# Altium schematic sheet Analyzer_PowerSchematic.SchDoc
size A3; SheetNumber: 3; SheetTotal: 3
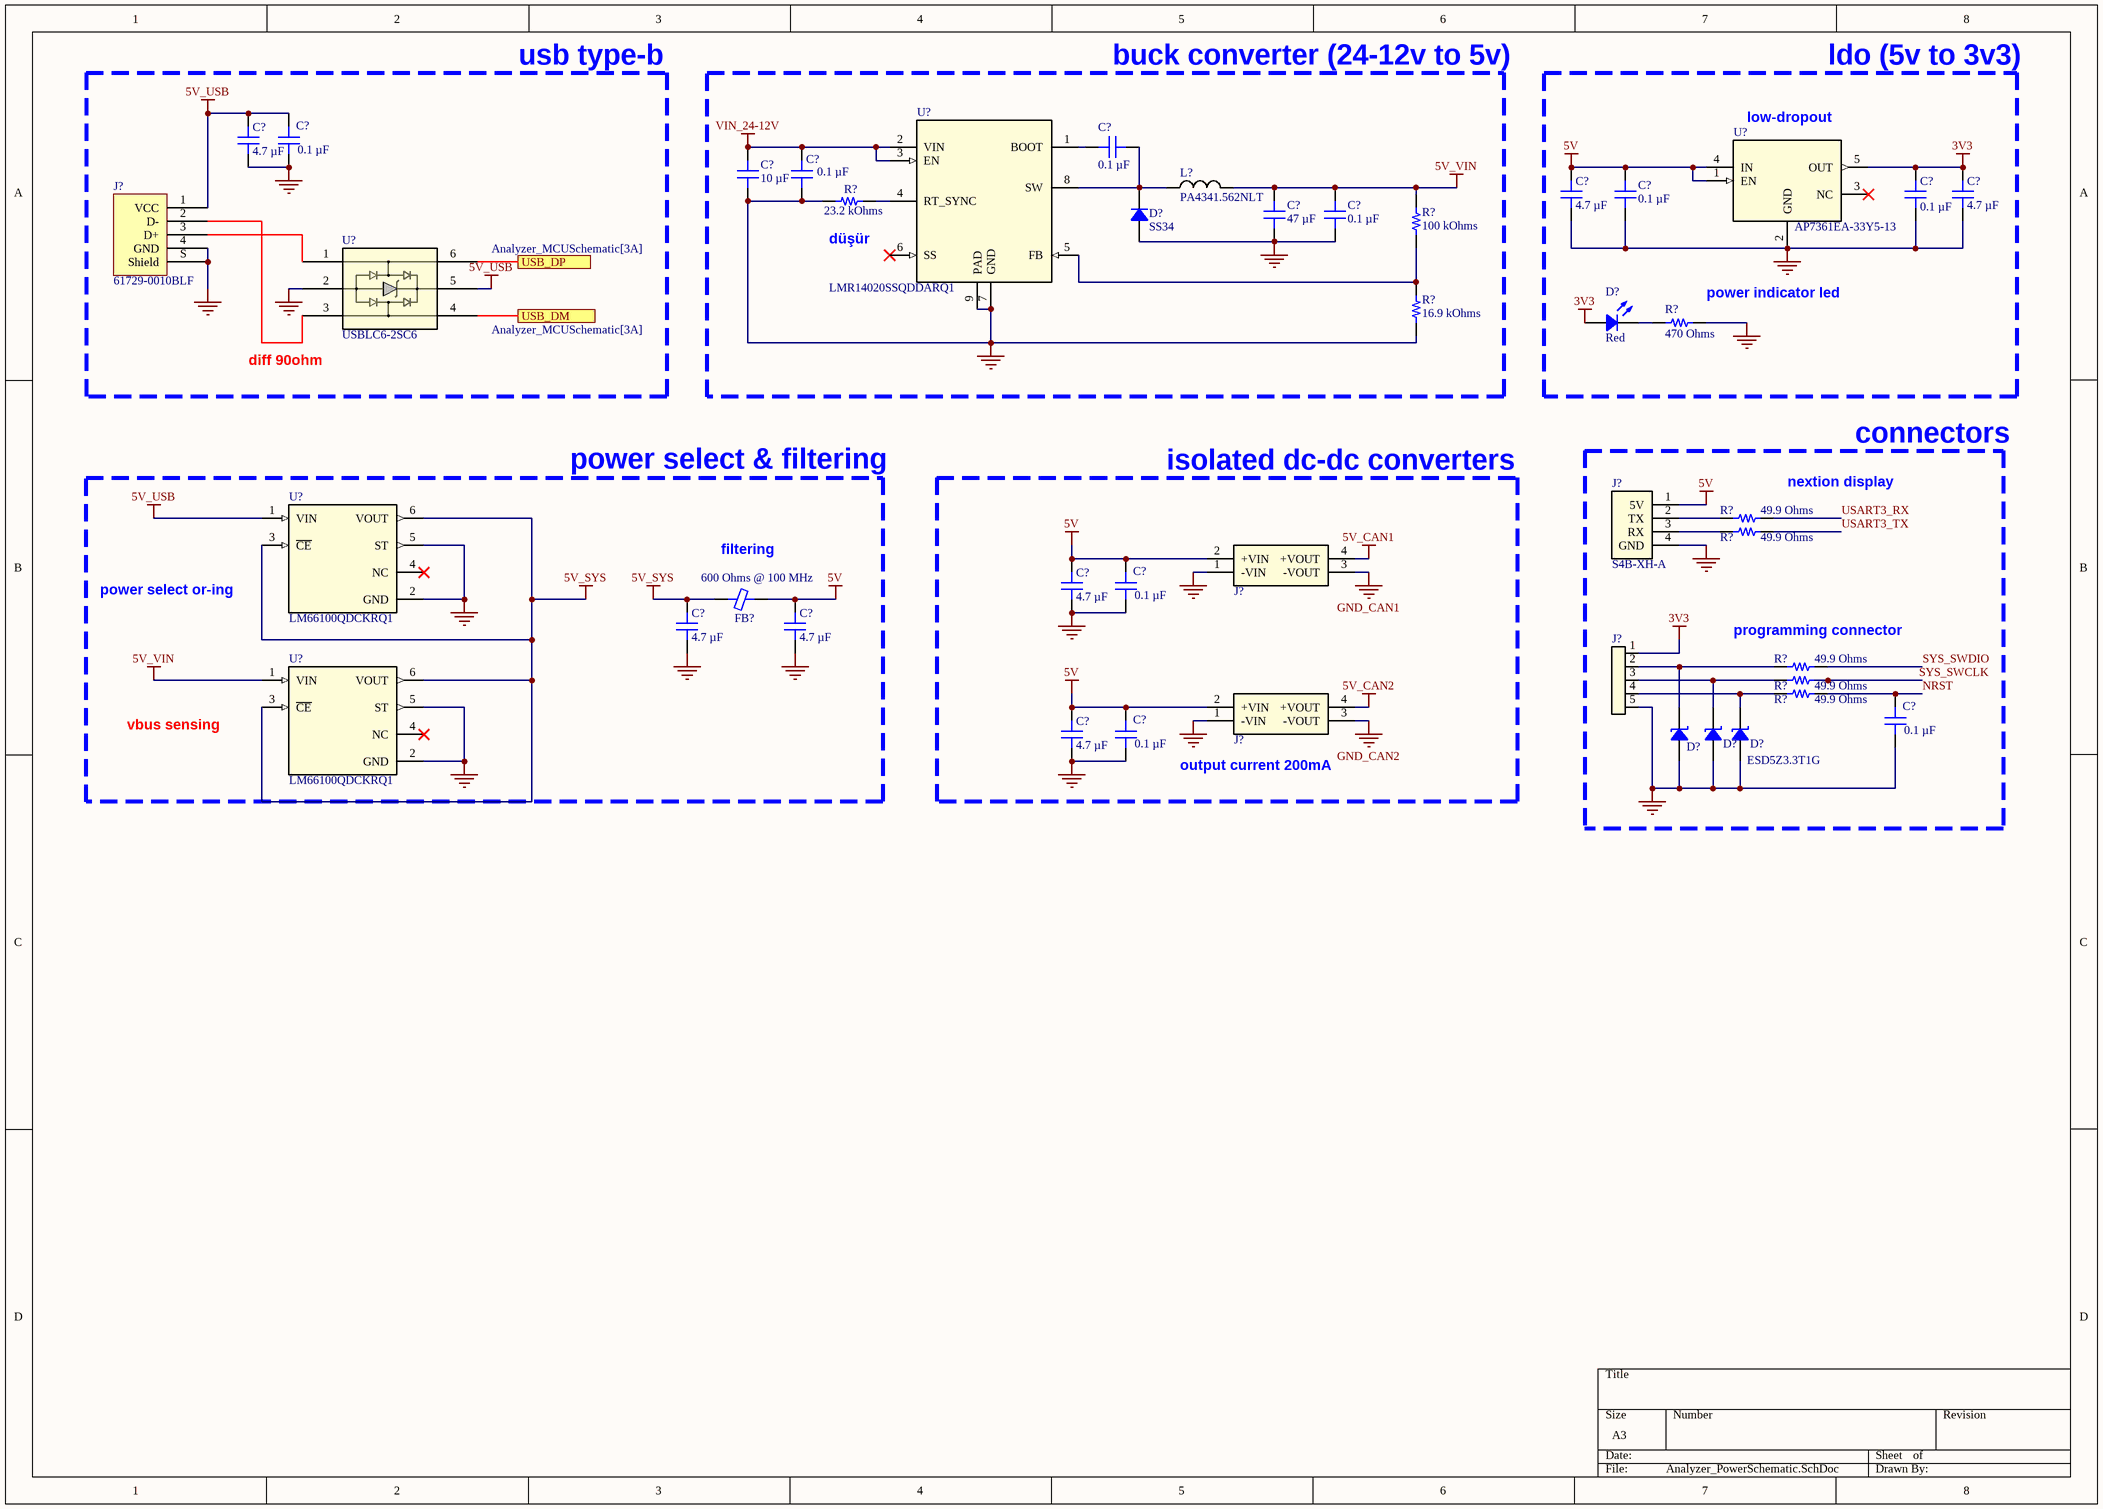
[diagram p0: Analyzer_PowerSchematic.SchDoc]

## Parts
(Parts that share a designator on the sheet are numbered #1, #2 ... from top to bottom, then left to right.)
C?#1  4.7 µF  [CAP 0603_1608]
C?#2  0.1 µF  [CAP 0603_1608]
C?#3  0.1 µF  [CAP 0603_1608]
C?#4  10 µF  [CAP 0805_2012]
C?#5  0.1 µF  [CAP 0603_1608]
C?#6  4.7 µF  [CAP 0603_1608]
C?#7  0.1 µF  [CAP 0603_1608]
C?#8  0.1 µF  [CAP 0603_1608]
C?#9  4.7 µF  [CAP 0603_1608]
C?#10  47 µF  [CAP 1206_3216 - 0.8MM]
C?#11  0.1 µF  [CAP 0603_1608]
C?#12  4.7 µF  [CAP 0603_1608]
C?#13  0.1 µF  [CAP 0603_1608]
C?#14  4.7 µF  [CAP 0603_1608]
C?#15  4.7 µF  [CAP 0603_1608]
C?#16  0.1 µF  [CAP 0603_1608]
C?#17  4.7 µF  [CAP 0603_1608]
C?#18  0.1 µF  [CAP 0603_1608]
D?#1  SS34  [DO214AB SMC]
D?#2  Red  [LED 0603_1608 RED]
D?#3  ESD5Z3.3T1G  [SOD523F]
D?#4  ESD5Z3.3T1G  [SOD523F]  (value not drawn)
D?#5  ESD5Z3.3T1G  [SOD523F]  (value not drawn)
FB?  600 Ohms @ 100 MHz  [FER 0603_1608]
J?#1  61729-0010BLF  [FCI USB 61729-0010BLF]
J?#2  S4B-XH-A  [JST_S4B-XH-A]
J?#3  CRE1S0505SC  [CRE1S0505SC]  (value not drawn)
J?#4  6130XX11121_61300511121  [61300511121]  (value not drawn)
J?#5  CRE1S0505SC  [CRE1S0505SC]  (value not drawn)
L?  PA4341.562NLT  [IND_222NLT_PUL]
R?#1  23.2 kOhms  [RES 0603_1608]
R?#2  100 kOhms  [RES 0603_1608]
R?#3  16.9 kOhms  [RES 0603_1608]
R?#4  470 Ohms  [RES 0603_1608]
R?#5  49.9 Ohms  [RES 0603_1608]
R?#6  49.9 Ohms  [RES 0603_1608]
R?#7  49.9 Ohms  [RES 0603_1608]
R?#8  49.9 Ohms  [RES 0603_1608]
R?#9  49.9 Ohms  [RES 0603_1608]
U?#1  AP7361EA-33Y5-13  [SOT89-5_DIO]
U?#2  LMR14020SSQDDARQ1  [DDA0008E_N]
U?#3  USBLC6-2SC6  [SOT95P280X145-6N]
U?#4  AUTOMOTIVE 1.5-V TO 5.5-V, 1.5-A  [SOT65P210X110-6N]  (value not drawn)
U?#5  AUTOMOTIVE 1.5-V TO 5.5-V, 1.5-A  [SOT65P210X110-6N]  (value not drawn)

## Blocks framed on the sheet
usb type-b: C?#1 C?#2 J?#1 U?#3
buck converter (24-12v to 5v): C?#3-C?#5 C?#10 C?#11 D?#1 L? R?#1-R?#3 U?#2
ldo (5v to 3v3): C?#6-C?#9 D?#2 R?#4 U?#1
connectors: C?#16 D?#3-D?#5 J?#2 J?#4 R?#5-R?#9
power select & filtering: C?#14 C?#15 FB? U?#4 U?#5
isolated dc-dc converters: C?#12 C?#13 C?#17 C?#18 J?#3 J?#5

## Ports
USB_DM (see Analyzer_MCUSchematic[3A]), USB_DP (see Analyzer_MCUSchematic[3A])

## Nets
3V3: C?#8.2 C?#9.2 D?#2.1 J?#4.1 U?#1.5(OUT)
5V: C?#6.2 C?#7.2 C?#12.2 C?#13.2 C?#15.2 C?#17.2 C?#18.2 FB?.2 J?#2.1(5V) J?#3.2(+VIN) J?#5.2(+VIN) U?#1.1(EN) U?#1.4(IN)
5V_CAN1: J?#3.4(+VOUT)
5V_CAN2: J?#5.4(+VOUT)
5V_SYS: C?#14.2 FB?.1 U?#4.3(~{CE}) U?#4.6(VOUT) U?#5.3(~{CE}) U?#5.6(VOUT)
5V_USB: C?#1.2 C?#2.2 J?#1.1(VCC) U?#3.5 U?#4.1(VIN)
5V_VIN: C?#10.2 C?#11.2 L?.1 R?#2.2 U?#5.1(VIN)
GND: C?#1.1 C?#2.1 C?#4.1 C?#5.1 C?#6.1 C?#7.1 C?#8.1 C?#9.1 C?#10.1 C?#11.1 C?#12.1 C?#13.1 C?#14.1 C?#15.1 C?#16.1 C?#17.1 C?#18.1 D?#1.1 D?#3.1 D?#4.1 D?#5.1 J?#1.4(GND) J?#1.S(Shield) J?#2.4(GND) J?#3.1(-VIN) J?#4.5 J?#5.1(-VIN) R?#1.2 R?#3.1 R?#4.2 U?#1.2(GND) U?#2.7(GND) U?#2.9(PAD) U?#3.2 U?#4.2(GND) U?#4.5(ST) U?#5.2(GND) U?#5.5(ST)
GND_CAN1: J?#3.3(-VOUT)
GND_CAN2: J?#5.3(-VOUT)
VIN_24-12V: C?#4.2 C?#5.2 U?#2.2(VIN) U?#2.3(EN)
NRST: C?#16.2 R?#9.2
SYS_SWCLK: R?#8.2
SYS_SWDIO: R?#7.2
USART3_RX: R?#5.2
USART3_TX: R?#6.2
USB_DM: U?#3.4 ; port USB_DM
USB_DP: U?#3.6 ; port USB_DP
NetC?#3_1: C?#3.1 D?#1.2 L?.2 U?#2.8(SW)
NetC?#3_2: C?#3.2 U?#2.1(BOOT)
NetD?#2_2: D?#2.2 R?#4.1
NetD?#3_2: D?#3.2 J?#4.2 R?#7.1
NetD?#4_2: D?#4.2 J?#4.3 R?#8.1
NetD?#5_2: D?#5.2 J?#4.4 R?#9.1
NetJ?#1_2: J?#1.2(D-) U?#3.3
NetJ?#1_3: J?#1.3(D+) U?#3.1
NetJ?#2_2: J?#2.2(TX) R?#5.1
NetJ?#2_3: J?#2.3(RX) R?#6.1
NetR?#1_1: R?#1.1 U?#2.4(RT_SYNC)
NetR?#2_1: R?#2.1 R?#3.2 U?#2.5(FB)

Not connected (* = marked no-connect by the designer): U?#1 3(NC)*; U?#2 6(SS)*; U?#4 4(NC)*; U?#5 4(NC)*

## Notes on the sheet
- (near U?#1) low-dropout
- (near R?#1) düşür
- (near R?#4) power indicator led
- (near U?#3) diff 90ohm
- (near R?#5) nextion display
- filtering
- (near U?#4) power select or-ing
- (near R?#7) programming connector
- vbus sensing
- output current 200mA

## Library data of the parts
C?#1 C?#6 C?#9 C?#12 C?#14 C?#15 C?#17 = 0603YW475KAT2A: CAP CER 4.7UF 16V X6S 0603; manufacturer: KYOCERA AVX; Tolerance: ±10%; Part Number: 0603YW475KAT2A; Capacitance: 4.7 µF; Applications: General Purpose; componentlink1description: Datasheet; componentlink1url: https://catalogs.kyocera-avx.com/SurfaceMount.pdf; componentlink2description: DigiKey Link; componentlink2url: https://www.digikey.com/en/products/detail/kyocera-avx/0603YW475KAT2A/14112130; Device Package: 0603 (1608 Metric); lastupdated: 6.04.2026 19:22:31; Lifecycle Status: Active; Minimum Order: 1; Mounting Type: Surface Mount, MLCC; Operating Temperature: -55°C ~ 105°C; Package / Case: 0603 (1608 Metric); packaging: TapeAndReel; partid: 35833; Part Status: Active; price: 0.07; series: -; Size / Dimension: 0.063" L x 0.031" W (1.60mm x 0.80mm); Supplier 1: DigiKey; Supplier Part Number 1: 478-0603YW475KAT2ACT-ND; Temperature Coefficient: X6S; Thickness (Max): 0.039" (1.00mm); value: 4.7 µF; Voltage - Rated: 16V
C?#2 C?#13 C?#16 C?#18 = CL10E104KC8VPNC: CAP CER 100NF 100V X8L 0603; manufacturer: Samsung Electro-Mechanics; Tolerance: ±10%; Part Number: CL10E104KC8VPNC; Capacitance: 0.1 µF; Applications: Automotive; componentlink1description: Datasheet; componentlink1url: https://mm.digikey.com/Volume0/opasdata/d220001/medias/docus/5458/CL10E104KC8VPNC_Spec.pdf; componentlink2description: DigiKey Link; componentlink2url: https://www.digikey.com/en/products/detail/samsung-electro-mechanics/CL10E104KC8VPNC/20498486; Device Package: 0603 (1608 Metric); Features: General Purpose; lastupdated: 6.04.2026 19:18:46; Lifecycle Status: Active; Minimum Order: 1; Mounting Type: Surface Mount, MLCC, Epoxy; Operating Temperature: -55°C ~ 150°C; Package / Case: 0603 (1608 Metric); packaging: TapeAndReel; partid: 68845; price: 0.04; Ratings: AEC-Q200; series: CL; Size / Dimension: 0.063" L x 0.031" W (1.60mm x 0.80mm); Supplier 1: DigiKey; Supplier Part Number 1: 1276-CL10E104KC8VPNCCT-ND; Temperature Coefficient: X8L; Thickness (Max): 0.035" (0.88mm); value: 0.1 µF; Voltage - Rated: 100V
C?#3 C?#5 C?#7 C?#8 C?#11 = 0603B104J160CT: CAP CER 0.1UF 16V X7R 0603; manufacturer: Walsin Technology Corporation; Tolerance: ±5%; Part Number: 0603B104J160CT; Capacitance: 0.1 µF; Applications: General Purpose; componentlink1description: Datasheet; componentlink1url: http://www.passivecomponent.com/wp-content/uploads/2018/10/MLCC.pdf; componentlink2description: DigiKey Link; componentlink2url: https://www.digikey.com/en/products/detail/walsin-technology-corporation/0603B104J160CT/9354886; Device Package: 0603 (1608 Metric); lastupdated: 6.04.2026 19:23:13; Lifecycle Status: Active; Minimum Order: 1; Mounting Type: Surface Mount, MLCC; Operating Temperature: -55°C ~ 125°C; Package / Case: 0603 (1608 Metric); packaging: TapeAndReel; partid: 13150; Part Status: Active; price: 0.01; series: -; Size / Dimension: 0.063" L x 0.031" W (1.60mm x 0.80mm); Supplier 1: DigiKey; Supplier Part Number 1: 1292-1389-1-ND; Temperature Coefficient: X7R; Thickness (Max): 0.034" (0.87mm); value: 0.1 µF; Voltage - Rated: 16V
C?#4 = C2012X7R1A106K125AE: CAP CER 10UF 10V X7R 0805; manufacturer: TDK Corporation; Tolerance: ±10%; Part Number: C2012X7R1A106K125AE; Capacitance: 10 µF; Applications: Boardflex Sensitive; componentlink1description: Datasheet; componentlink1url: https://product.tdk.com/info/en/catalog/datasheets/mlcc_commercial_soft_en.pdf?ref_disty=digikey; componentlink2description: DigiKey Link; componentlink2url: https://www.digikey.com/en/products/detail/tdk-corporation/C2012X7R1A106K125AE/5809181; Device Package: 0805 (2012 Metric); Features: Soft Termination; lastupdated: 6.04.2026 19:33:17; Lifecycle Status: Active; Minimum Order: 1; Mounting Type: Surface Mount, MLCC; Operating Temperature: -55°C ~ 125°C; Package / Case: 0805 (2012 Metric); packaging: TapeAndReel; partid: 3036; Part Status: Active; price: 0.08; series: C; Size / Dimension: 0.079" L x 0.049" W (2.00mm x 1.25mm); Supplier 1: DigiKey; Supplier Part Number 1: 445-173616-1-ND; Temperature Coefficient: X7R; Thickness (Max): 0.059" (1.50mm); value: 10 µF; Voltage - Rated: 10V
C?#10 = C3216X5R1E476M160AC: CAP CER 47UF 25V X5R 1206; manufacturer: TDK Corporation; Tolerance: ±20%; Part Number: C3216X5R1E476M160AC; Capacitance: 47 µF; Applications: General Purpose; componentlink1description: Datasheet; componentlink1url: https://product.tdk.com/info/en/catalog/datasheets/mlcc_commercial_general_en.pdf?ref_disty=digikey; componentlink2description: DigiKey Link; componentlink2url: https://www.digikey.com/en/products/detail/tdk-corporation/C3216X5R1E476M160AC/2792260; Device Package: 1206 (3216 Metric); Features: Low ESL; lastupdated: 6.04.2026 19:37:32; Lifecycle Status: Active; Minimum Order: 1; Mounting Type: Surface Mount, MLCC; Operating Temperature: -55°C ~ 85°C; Package / Case: 1206 (3216 Metric); packaging: TapeAndReel; partid: 47432; Part Status: Active; price: 0.25; series: C; Size / Dimension: 0.126" L x 0.063" W (3.20mm x 1.60mm); Supplier 1: DigiKey; Supplier Part Number 1: 445-8047-1-ND; Temperature Coefficient: X5R; Thickness (Max): 0.071" (1.80mm); value: 47 µF; Voltage - Rated: 25V
D?#1 = SS34: DIODE SCHOTTKY 40V 3A SMC; Manufacturer: ON Semiconductor; Current - Reverse Leakage @ Vr: 500µA @ 40V; Speed: Fast Recovery =< 500ns, > 200mA (Io); Voltage - Forward (Vf) (Max) @ If: 500mV @ 3A; Part Number: SS34; ComponentLink1Description: Datasheet; ComponentLink1URL: https://www.onsemi.com/pub/Collateral/SS39-D.PDF; ComponentLink2Description: DigiKey Link; ComponentLink2URL: http://digikey.com/product-detail/en/on-semiconductor/SS34/SS34FSCT-ND/2094459; Current - Average Rectified (Io): 3A; Diode Type: Schottky; LastUpdated: 5.04.2026 20:31:17; Lifecycle Status: Active; Minimum Order: 1; Mounting Type: Surface Mount; Operating Temperature - Junction: -55°C ~ 150°C; Package / Case: DO-214AB, SMC; Packaging: TapeAndReel; PartId: 1654; Part Status: Active; Price: 0.16; Series: -; Supplier 1: DigiKey; Supplier Part Number 1: SS34FSCT-ND; Supplier Device Package: SMC (DO-214AB); Voltage - DC Reverse (Vr) (Max): 40V
D?#2 = 5973035507F: LED RED 0603 SMD; Manufacturer: Dialight; Configuration: Standard; Current - Test: 20mA; Lens Color: 0.68mm; Lens Size: 1.20mm x 0.80mm; Lens Style: Rectangle with Flat Top; Millicandela Rating: 112mcd; Voltage - Forward (Vf) (Typ): 2V; Wavelength - Dominant: 620nm; Part Number: 5973035507F; Color: Red; ComponentLink1Description: Datasheet; ComponentLink1URL: http://www.dialightsignalsandcomponents.com/Assets/Drawings/2D_Drawings_DrawingDetailedSpec/NewDrawings/18369A.pdf; ComponentLink2Description: DigiKey Link; ComponentLink2URL: https://www.digikey.com/en/products/detail/dialight/5973035507F/9385430; Device Package: 0603 (1608 Metric); Height (Max): 0.68mm; LastUpdated: 5.04.2026 20:38:00; Lifecycle Status: Active; Minimum Order: 1; Mounting Type: Surface Mount; Package / Case: 0603 (1608 Metric); Packaging: TapeAndReel; PartId: 379; Part Status: Active; Price: 0.09; Series: 597; Size / Dimension: 1.60mm L x 0.80mm W; Supplier 1: DigiKey; Supplier Part Number 1: 350-4375-1-ND; Supplier Device Package: 0603; Value: Red
D?#3-D?#5 = ESD5Z3.3T1G: TVS DIODE 3.3V 14.1V SOD523; Manufacturer: ON Semiconductor; Capacitance @ Frequency: 105pF @ 1MHz; Current - Peak Pulse (10/1000µs): 11.2A (8/20µs); Power Line Protection: No; Power - Peak Pulse: 158W; Type: Zener; Unidirectional Channels: 1; Voltage - Breakdown (Min): 5V; Voltage - Reverse Standoff (Typ): 3.3V (Max); Part Number: ESD5Z3.3T1G; Applications: General Purpose; ComponentLink1Description: Datasheet; ComponentLink1URL: https://www.onsemi.com/pub/Collateral/ESD5Z2.5T1-D.PDF; ComponentLink2Description: DigiKey Link; ComponentLink2URL: http://digikey.com/product-detail/en/on-semiconductor/ESD5Z3.3T1G/ESD5Z3.3T1GOSCT-ND/1967044; LastUpdated: 5.04.2026 21:01:13; Lifecycle Status: Active; Minimum Order: 1; Mounting Type: Surface Mount; Operating Temperature: -55°C ~ 150°C (TJ); Package / Case: SC-79, SOD-523; Packaging: TapeAndReel; PartId: 9754; Part Status: Active; Price: 0.04; Series: -; Supplier 1: DigiKey; Supplier Part Number 1: ESD5Z3.3T1GOSCT-ND; Supplier Device Package: SOD-523; Voltage - Clamping (Max) @ Ipp: 14.1V
FB? = GZ1608D601TF: FERRITE BEAD 600 OHM 0603 1LN; Manufacturer: Shenzhen Sunlord Electronics Co., Ltd.; Current Rating (Max): 200mA; DC Resistance (DCR) (Max): 450mOhm; Filter Type: Signal Line; Number of Lines: 1; Part Number: GZ1608D601TF; ComponentLink1Description: Datasheet; ComponentLink1URL: https://www.sunlordinc.com/Download.aspx?file=L1VwbG9hZEZpbGVzL1BERl9DYXQvMjAxOTA0MDgxMzU0MTk3NjMucGRm&lan=en; ComponentLink2Description: DigiKey Link; ComponentLink2URL: https://www.digikey.com/en/products/detail/shenzhen-sunlord-electronics-co-ltd/GZ1608D601TF/14120345; Device Package: 0603 (1608 Metric); Height (Max): 0.037" (0.95mm); Impedance @ Frequency: 600 Ohms @ 100 MHz; LastUpdated: 5.04.2026 20:28:01; Lifecycle Status: Active; Minimum Order: 1; Mounting Type: Surface Mount; Operating Temperature: -55°C ~ 125°C; Package / Case: 0603 (1608 Metric); Packaging: TapeAndReel; PartId: 2637; Part Status: Active; Price: 0.01; Series: GZ; Size / Dimension: 0.063" L x 0.031" W (1.60mm x 0.80mm); Supplier 1: DigiKey; Supplier Part Number 1: 3442-GZ1608D601TFCT-ND; Value: 600 Ohms @ 100 MHz
J?#1 = 61729-0010BLF: CONN RCPT USB2.0 TYPEB 4POS R/A; Manufacturer: Amphenol ICC (FCI); Connector Type: USB - B; Current Rating (Amps): 1A; Gender: Receptacle; Mating Cycles: 1500; Number of Contacts: 4; Number of Ports: 1; Shielding: Shielded; Part Number: 61729-0010BLF; ComponentLink1Description: Datasheet; ComponentLink1URL: http://www.amphenol-icc.com/media/wysiwyg/files/drawing/61729.pdf; ComponentLink2Description: DigiKey Link; ComponentLink2URL: //digikey.com/product-detail/en/amphenol-icc-fci/61729-0010BLF/609-1039-ND/1001353; Features: Board Lock; LastUpdated: 9.12.2019 20:53:17; Lifecycle Status: 0; Minimum Order: 1; Mounting Feature: Horizontal; Mounting Type: Through Hole, Right Angle; Operating Temperature: -55°C ~ 85°C; Packaging: Tube; Part Status: Active; Price: 0.99; Series: 61729; Specifications: USB 2.0; Supplier 1: DigiKey; Supplier Part Number 1: 609-1039-ND; Termination: Solder
J?#3 J?#5 = CRE1S0505SC: Module DC-DC 5VIN 1-OUT 5V 0.2A 1W 4-Pin SIP Module Tube; Manufacturer_Name: Murata Electronics; Geometry.Height: 10.25mm; Manufacturer_Part_Number: CRE1S0505SC; Mouser Part Number: 580-CRE1S0505SC; Mouser Price/Stock: https://www.mouser.co.uk/ProductDetail/Murata-Power-Solutions/CRE1S0505SC?qs=pFP7BvE1PmyBR9paOK5h%2FA%3D%3D; Arrow Part Number: CRE1S0505SC; Arrow Price/Stock: https://www.arrow.com/en/products/cre1s0505sc/murata-power-solutions?utm_currency=USD&region=nac; Datasheet Link: https://www.mouser.com/datasheet/2/281/kdc_cre1-951969.pdf; ComponentLink1Description: Datasheet; ComponentLink1URL: https://pim.murata.com/asset/pim4/isolatedDCDCconverter/KDC_CRE1_PDF_ISOLATEDDCDCCONVERTER?lastModifiedDatetime=20250707193457
J?#4 = 6130XX11121_61300511121: MF: {'manufacturer': u'W\xfcrth Elektronik'}; Package: None; Price: None; Value: *; MP: 61300511121; Availability: Unavailable
L? = PA4341.562NLT: FIXED IND 5.6UH 5A 48 MOHM SMD; Manufacturer_Name: Pulse Electronics Corporation; Copyright: Copyright (C) 2026 Ultra Librarian. All rights reserved.; Manufacturer_Part_Number: PA4341.562NLT
R?#1 = RT0603BRD0723K2L: RES SMD 23.2KOHM 0.1% 1/10W 0603; Manufacturer: Yageo; Power (Watts): 0.1W, 1/10W; Temperature Coefficient: ±25ppm/°C; Part Number: RT0603BRD0723K2L; Value: 23.2 kOhms; ComponentLink1Description: Datasheet; ComponentLink1URL: https://www.yageo.com/upload/media/product/productsearch/datasheet/rchip/PYu-RT_1-to-0.01_RoHS_L_11.pdf; ComponentLink2Description: DigiKey Link; ComponentLink2URL: https://www.digikey.com/en/products/detail/yageo/RT0603BRD0723K2L/1072377; Composition: Thin Film; Device Package: 0603 (1608 Metric); Height - Seated (Max): 0.022" (0.55mm); LastUpdated: 6.04.2026 19:43:56; Lifecycle Status: Active; Minimum Order: 1; Number of Terminations: 2; Operating Temperature: -55°C ~ 155°C; Package / Case: 0603 (1608 Metric); Packaging: TapeAndReel; PartId: 10303; Part Status: Active; Price: 0.03; Resistance: 23.2 kOhms; Series: RT; Size / Dimension: 0.063" L x 0.031" W (1.60mm x 0.80mm); Supplier 1: DigiKey; Supplier Part Number 1: YAG4507CT-ND; Supplier Device Package: 0603; Tolerance: ±0.1%
R?#2 = RT0603BRD07100KL: RES SMD 100K OHM 0.1% 1/10W 0603; Manufacturer: Yageo; Power (Watts): 0.1W, 1/10W; Temperature Coefficient: ±25ppm/°C; Part Number: RT0603BRD07100KL; Value: 100 kOhms; ComponentLink1Description: Datasheet; ComponentLink1URL: https://www.yageo.com/upload/media/product/productsearch/datasheet/rchip/PYu-RT_1-to-0.01_RoHS_L_11.pdf; ComponentLink2Description: DigiKey Link; ComponentLink2URL: https://www.digikey.com/en/products/detail/yageo/RT0603BRD07100KL/1072187; Composition: Thin Film; Device Package: 0603 (1608 Metric); Height - Seated (Max): 0.022" (0.55mm); LastUpdated: 6.04.2026 19:44:01; Lifecycle Status: Active; Minimum Order: 1; Number of Terminations: 2; Operating Temperature: -55°C ~ 155°C; Package / Case: 0603 (1608 Metric); Packaging: TapeAndReel; PartId: 5628; Part Status: Active; Price: 0.03; Resistance: 100 kOhms; Series: RT; Size / Dimension: 0.063" L x 0.031" W (1.60mm x 0.80mm); Supplier 1: DigiKey; Supplier Part Number 1: YAG1235CT-ND; Supplier Device Package: 0603; Tolerance: ±0.1%
R?#3 = RC0603FR-0716K9L: RES 16.9K OHM 1% 1/10W 0603; Manufacturer: Yageo; Power (Watts): 0.1W, 1/10W; Temperature Coefficient: ±100ppm/°C; Part Number: RC0603FR-0716K9L; Value: 16.9 kOhms; ComponentLink1Description: Datasheet; ComponentLink1URL: https://www.yageo.com/upload/media/product/productsearch/datasheet/rchip/PYu-RC_Group_51_RoHS_L_10.pdf; ComponentLink2Description: DigiKey Link; ComponentLink2URL: https://www.digikey.com/en/products/detail/yageo/RC0603FR-0716K9L/726971; Composition: Thick Film; Device Package: 0603 (1608 Metric); Features: Moisture Resistant; Height - Seated (Max): 0.022" (0.55mm); LastUpdated: 6.04.2026 19:43:54; Lifecycle Status: Active; Minimum Order: 1; Number of Terminations: 2; Operating Temperature: -55°C ~ 155°C; Package / Case: 0603 (1608 Metric); Packaging: CutTape; PartId: 12287; Part Status: Active; Price: 0.01; Resistance: 16.9 kOhms; Series: RC_L; Size / Dimension: 0.063" L x 0.031" W (1.60mm x 0.80mm); Supplier 1: DigiKey; Supplier Part Number 1: 311-16.9KHRCT-ND; Supplier Device Package: 0603; Tolerance: ±1%
R?#4 = RMCF0603JT470R: RES 470 OHM 5% 1/10W 0603; Manufacturer: Stackpole Electronics Inc; Power (Watts): 0.1W, 1/10W; Temperature Coefficient: ±200ppm/°C; Part Number: RMCF0603JT470R; Value: 470 Ohms; ComponentLink1Description: Datasheet; ComponentLink1URL: https://www.seielect.com/catalog/sei-rmcf_rmcp.pdf; ComponentLink2Description: DigiKey Link; ComponentLink2URL: https://www.digikey.com/en/products/detail/stackpole-electronics-inc/RMCF0603JT470R/1757954; Composition: Thick Film; Device Package: 0603 (1608 Metric); Features: Automotive AEC-Q200; Height - Seated (Max): 0.022" (0.55mm); LastUpdated: 9.02.2024 20:43:33; Lifecycle Status: Active; Minimum Order: 1; Number of Terminations: 2; Operating Temperature: -55°C ~ 155°C; Package / Case: 0603 (1608 Metric); Packaging: CutTape; PartId: 5857; Part Status: Active; Price: 0.01; Ratings: AEC-Q200; Resistance: 470 Ohms; Series: RMCF; Size / Dimension: 0.061" L x 0.031" W (1.55mm x 0.80mm); Supplier 1: DigiKey; Supplier Part Number 1: RMCF0603JT470RCT-ND; Supplier Device Package: 0603; Tolerance: ±5%
R?#5-R?#9 = RT0603BRD0749R9L: RES SMD 49.9 OHM 0.1% 1/10W 0603; Manufacturer: Yageo; Power (Watts): 0.1W, 1/10W; Temperature Coefficient: ±25ppm/°C; Part Number: RT0603BRD0749R9L; Value: 49.9 Ohms; ComponentLink1Description: Datasheet; ComponentLink1URL: https://www.yageo.com/upload/media/product/productsearch/datasheet/rchip/PYu-RT_1-to-0.01_RoHS_L_11.pdf; ComponentLink2Description: DigiKey Link; ComponentLink2URL: https://www.digikey.com/en/products/detail/yageo/RT0603BRD0749R9L/1072551; Composition: Thin Film; Device Package: 0603 (1608 Metric); Height - Seated (Max): 0.022" (0.55mm); LastUpdated: 6.04.2026 19:43:55; Lifecycle Status: Active; Minimum Order: 1; Number of Terminations: 2; Operating Temperature: -55°C ~ 155°C; Package / Case: 0603 (1608 Metric); Packaging: TapeAndReel; PartId: 10411; Part Status: Active; Price: 0.03; Resistance: 49.9 Ohms; Series: RT; Size / Dimension: 0.063" L x 0.031" W (1.60mm x 0.80mm); Supplier 1: DigiKey; Supplier Part Number 1: YAG1672CT-ND; Supplier Device Package: 0603; Tolerance: ±0.1%
U?#1 = AP7361EA-33Y5-13: No Description Available; Manufacturer_Name: Diodes Inc; Type: Power Management; Copyright: Copyright (C) 2026 Ultra Librarian. All rights reserved.; Manufacturer_Part_Number: AP7361EA-33Y5-13; Digi-Key_Part_Number_1: 31-AP7361EA-33Y5-13TR-ND; Digi-Key_Part_Number_2: 31-AP7361EA-33Y5-13CT-ND; Digi-Key_Part_Number_3: 31-AP7361EA-33Y5-13DKR-ND; RefDes: RefDes
U?#2 = LMR14020SSQDDARQ1: SIMPLE SWITCHERÂ® Automotive 40-V, 2-A, 2.2-MHz step-down converter with 40-uA IQ 8-SO PowerPAD -40 to 125; Manufacturer_Name: Texas Instruments; PartNumber: LMR14020SQDDARQ1; CompType: IC; TYPE: TYPE; RefDes: RefDes; Copyright: Copyright (C) 2026 Ultra Librarian. All rights reserved.; Manufacturer_Part_Number: LMR14020SSQDDARQ1; Datasheet: https://www.ti.com/lit/gpn/lmr14020-q1; Digi-Key_Part_Number_1: 296-43399-1-ND; Digi-Key_Part_Number_2: 296-43399-2-ND; Digi-Key_Part_Number_3: 296-43399-6-ND; Application_BuildNumber: *; PackageReference: DDA0008E; MountType: SMT; RoHS: Y; Manufacturer: Texas Instruments
U?#3 = USBLC6-2SC6_1: ESD Protection for USB 2.0 High Speed; Manufacturer_Name: STMicroelectronics; Copyright: Copyright (C) 2025 Ultra Librarian. All rights reserved.; Manufacturer_Part_Number: USBLC6-2SC6; RefDes: RefDes; Type: Type
U?#4 U?#5 = LM66100QDCKRQ1: Automotive 1.5-V to 5.5-V, 1.5-A, 0.5-µA IQ ideal diode with integrated FET 6-SC70 -40 to 125; Manufacturer: Texas Instruments; Manufacturer Lifecycle Status: ACTIVE; Number of Channels: 1; Supplier 1: Mouser; RoHS: Compliant; Category: Integrated Circuits (ICs); Stock 1: 6230; Pricing 1: 1=0,44, 10=0,3, 50=0,268, 100=0,231, 1000=0,192, 10000=0,162 (USD); Height: 1.1mm; Length: 2mm; Lifecycle Status: Production; Pins: 6; Thickness: 900µm; Width: 1.25mm; ComponentLink1URL: https://sigma.octopart.com:443/182282881/technical_drawing/Texas-Instruments-LM66100QDCKRQ1.pdf?src-supplier=Texas+Instruments; ComponentLink1Description: https://sigma.octopart.com:443/182282881/technical_drawing/Texas-Instruments-LM66100QDCKRQ1.pdf?src-supplier=Texas+Instruments; ComponentLink2URL: https://octopart.com:443/opatz8j6/c1?t=jdCLViSIeG4YZ9ZuzKCNxeHrtAYQiHtjLnoCJdnTkIENZAXXnoDYtDpVz_daszEZ_omeOgwbrmFBYUi5AkwR7eM8t8iZ72RfnlqvGwU6_jE4yrwgMEwg-2HSYoRDjytZp9KEDB5B7l-qBb_fnzZ_WbvaCPx5IiWZMXl9PVcFNlkcLpwihJYGvxRy4vGQaZq3LCN_wBmFWhmOfA5zAVyTEG5l2uxwd52RgyhD8dKhsgT7_r7ZepCD5zY5saeBipI4fS3N7MZVpLru2ehYOJw6de9vorOe3pZYJsFY7-OBR0BSaU0hfOEKG-rDaEGOFQc-ZQaZyMD6ilOsSvDf3YEp-B7J1W4vq7lfTsucZ8Rly6Y4JHbpczoF_K_FgpkXTM47lS3C0Hxri0uf&src-supplier=Texas+Instruments; ComponentLink2Description: https://octopart.com:443/opatz8j6/c1?t=jdCLViSIeG4YZ9ZuzKCNxeHrtAYQiHtjLnoCJdnTkIENZAXXnoDYtDpVz_daszEZ_omeOgwbrmFBYUi5AkwR7eM8t8iZ72RfnlqvGwU6_jE4yrwgMEwg-2HSYoRDjytZp9KEDB5B7l-qBb_fnzZ_WbvaCPx5IiWZMXl9PVcFNlkcLpwihJYGvxRy4vGQaZq3LCN_wBmFWhmOfA5zAVyTEG5l2uxwd52RgyhD8dKhsgT7_r7ZepCD5zY5saeBipI4fS3N7MZVpLru2ehYOJw6de9vorOe3pZYJsFY7-OBR0BSaU0hfOEKG-rDaEGOFQc-ZQaZyMD6ilOsSvDf3YEp-B7J1W4vq7lfTsucZ8Rly6Y4JHbpczoF_K_FgpkXTM47lS3C0Hxri0uf&src-supplier=Texas+Instruments; ComponentLink3URL: https://sigma.octopart.com:443/178868976/technical_drawing/Texas-Instruments-LM66100QDCKRQ1.pdf?src-supplier=Texas+Instruments; ComponentLink3Description: https://sigma.octopart.com:443/178868976/technical_drawing/Texas-Instruments-LM66100QDCKRQ1.pdf?src-supplier=Texas+Instruments; ComponentLink4URL: https://datasheet.octopart.com:443/LM66100QDCKRQ1-Texas-Instruments-datasheet-164731151.pdf?src-supplier=ODG+(Origin+Data+Global); ComponentLink4Description: https://datasheet.octopart.com:443/LM66100QDCKRQ1-Texas-Instruments-datasheet-164731151.pdf?src-supplier=ODG+(Origin+Data+Global); ComponentLink5URL: http://sigma.octopart.com:80/reach_statement/Texas-Instruments-company-64.pdf?src-supplier=Compliance+Statements; ComponentLink5Description: http://sigma.octopart.com:80/reach_statement/Texas-Instruments-company-64.pdf?src-supplier=Compliance+Statements; ComponentLink6URL: http://sigma.octopart.com:80/conflict_mineral_statement/Texas-Instruments-company-63.pdf?src-supplier=Compliance+Statements; ComponentLink6Description: http://sigma.octopart.com:80/conflict_mineral_statement/Texas-Instruments-company-63.pdf?src-supplier=Compliance+Statements; Supplier Part Number 1: 595-LM66100QDCKRQ1; Manufacturer Part Number: LM66100QDCKRQ1
J?#2 = S4B-XH-A: Package: None; Price: None; Value: *; MP: S4B-XH-A; Availability: Unavailable